# EasyEDA Pro project PowerStack.epro, schematic Schematic1
Board Name: Board1; Create Date: 2026-05-18; Page Name: P1; Project Name: Powerpi Stack; Schematic Name: Schematic1; Update Date: 2026-05-21; Company: EasyEDA.com; Page Size: A4; Version: V1.0
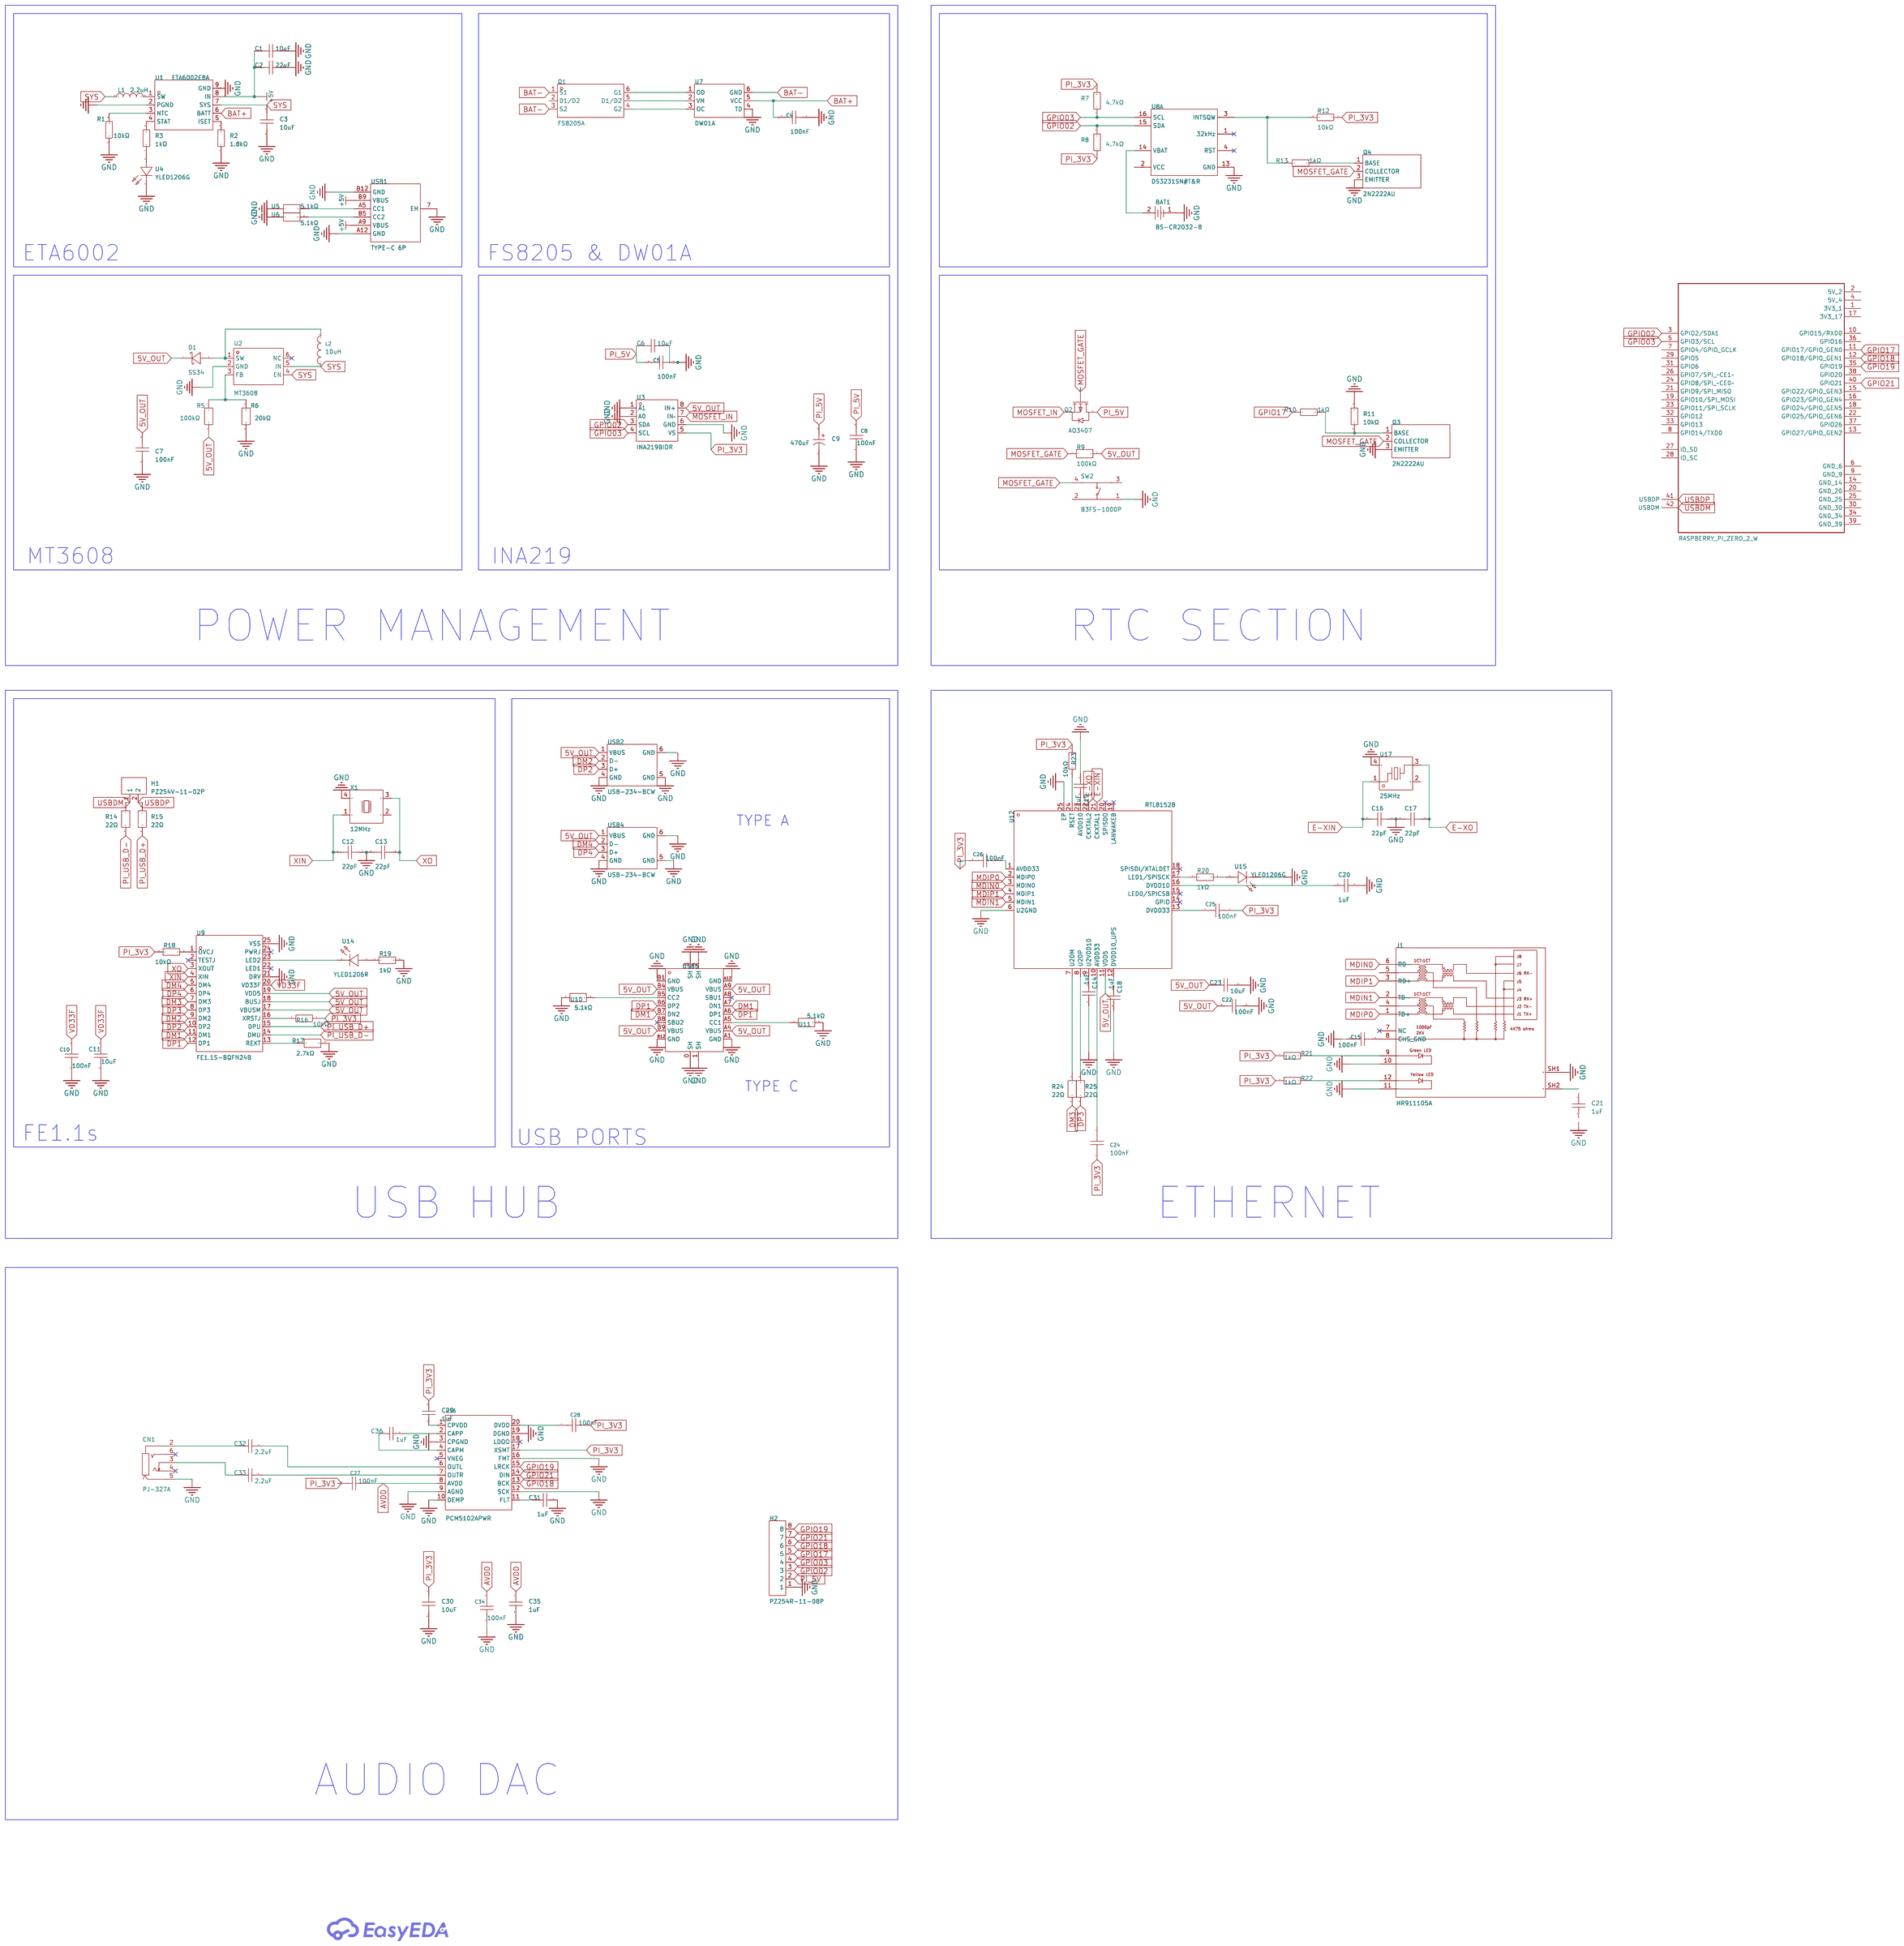
[diagram p0: schematic sheet]

## Parts
BAT1  BS-CR2032-8  [BAT-SMD_BS-CR2032-8]
C1  10uF  [C0603]
C2  22uF  [C0603]
C3  10uF  [C0603]
C4  100nF  [C0603]
C5  100nF  [C0603]
C6  10uF  [C0603]
C7  100nF  [C0603]
C8  100nF  [C0603]
C9  470uF  [CAP-SMD_BD6.3-L6.6-W6.6-FD]
C10  100nF  [C0603]
C11  10uF  [C0603]
C12  22pF  [C0603]
C13  22pF  [C0603]
C14  1uF  [C0603]
C15  100nF  [C0603]
C16  22pF  [C0603]
C17  22pF  [C0603]
C18  1uF  [C0603]
C19  1uF  [C0603]
C20  1uF  [C0603]
C21  1uF  [C0603]
C22  100nF  [C0603]
C23  10uF  [C0603]
C24  100nF  [C0603]
C25  100nF  [C0603]
C26  100nF  [C0603]
C27  100nF  [C0603]
C28  100nF  [C0603]
C29  1uF  [C0603]
C30  10uF  [C0603]
C31  1uF  [C0603]
C32  2.2uF  [C0603]
C33  2.2uF  [C0603]
C34  100nF  [C0603]
C35  1uF  [C0603]
C36  1uF  [C0603]
CN1  PJ-327A  [AUDIO-SMD_XUNPU_PJ-327A]
D1  SS34  [SMA_L4.3-W2.6-LS5.1-RD]
H1  PZ254V-11-02P  [HDR-TH_2P-P2.54-V-M]
H2  PZ254R-11-08P  [HDR-TH_8P-P2.54-H-M-W10.4]
J1  HR911105A  [RJ45-TH_HR911105A]
L1  2.2uH  [IND-SMD_L5.4-W5.2]
L2  10uH  [IND-SMD_L5.2-W5.2_MCW-0530]
Q1  FS8205A  [SOT-23-6_L2.9-W1.6-P0.95-LS2.8-BR]
Q2  AO3407  [SOT-23-3_L2.9-W1.6-P1.90-LS2.8-BR]
Q3  2N2222AU  [SOT-89-3_L4.5-W2.4-P1.50-LS4.0-BR]
Q4  2N2222AU  [SOT-89-3_L4.5-W2.4-P1.50-LS4.0-BR]
R1  10kΩ  [R0603_NEW]
R2  1.8kΩ  [R0603_NEW]
R3  1kΩ  [R0603_NEW]
R5  100kΩ  [R0603_NEW]
R6  20kΩ  [R0603_NEW]
R7  4.7kΩ  [R0603_NEW]
R8  4.7kΩ  [R0603_NEW]
R9  100kΩ  [R0603_NEW]
R10  1kΩ  [R0603_NEW]
R11  10kΩ  [R0603_NEW]
R12  10kΩ  [R0603_NEW]
R13  1kΩ  [R0603_NEW]
R14  22Ω  [R0603_NEW]
R15  22Ω  [R0603_NEW]
R16  10kΩ  [R0603_NEW]
R17  2.7kΩ  [R0603_NEW]
R18  10kΩ  [R0603_NEW]
R19  1kΩ  [R0603_NEW]
R20  1kΩ  [R0603_NEW]
R21  1kΩ  [R0603_NEW]
R22  1kΩ  [R0603_NEW]
R23  10kΩ  [R0603_NEW]
R24  22Ω  [R0603_NEW]
R25  22Ω  [R0603_NEW]
SW2  B3FS-1000P  [KEY-SMD_4P-L6.0-W6.3-P4.50-LS8.0]
U1  ETA6002E8A  [ESOP-8_L4.9-W3.9-P1.27-LS6.0-BL-EP-1]
U2  MT3608  [SOT-23-6_L2.9-W1.6-P0.95-LS2.8-BL]
U3  INA219BIDR  [SOIC-8_L5.0-W4.0-P1.27-LS6.1-BL]
U4  YLED1206G  [LED1206-RD]
U5  5.1kΩ  [R0603_NEW]
U6  5.1kΩ  [R0603_NEW]
U7  DW01A  [SOT-23-6_L2.9-W1.6-P0.95-LS2.8-BL]
U8  DS3231SN#T&R  [SOIC-16_L10.3-W7.5-P1.27-LS10.3-BL]  (section 1)
U9  FE1.1S-BQFN24B  [WQFN-24_L4.0-W4.0-P0.50-TL-EP2.7]
U10  5.1kΩ  [R0603_NEW]
U11  5.1kΩ  [R0603_NEW]
U12  RTL8152B  [QFN-24_L4.0-W4.0-P0.50-BL-EP2.0]
U14  YLED1206R  [LED1206-FD]
U15  YLED1206G  [LED1206-RD]
U16  PCM5102APWR  [TSSOP-20_L6.5-W4.4-P0.65-LS6.4-BL]
U17  25MHz  [CRYSTAL-SMD_4P-L2.0-W1.6-BL]
U18  RASPBERRY_PI_ZERO_2_W  [MODULE_RASPBERRY_PI_ZERO_2_W]
USB1  TYPE-C 6P  [TYPE-C-SMD_TYPE-C-6P_1]
USB2  USB-234-BCW  [USB-A-SMD_USB-234-BCW]
USB4  USB-234-BCW  [USB-A-SMD_USB-234-BCW]
USB5  TYPE C  [USB-C_SMD-TYPE-C-31-M-12]
X1  12MHz  [OSC-SMD_4P-L5.0-W3.2-BL_SG5032]

## Library data of the parts
BAT1 = BS-CR2032-8: Connector Type:Battery Holder Battery Type:CR2032 Contact Material:- Contact Plating:Gold Operating Temperature:-40℃~+85℃ Operating Temperature:-40℃~+85℃; LCSC Part Name: 电池底座 适用电池:CR2032; Supplier Part: C7498149; Manufacturer: LX(连欣科技); Supplier Footprint: SMD; JLCPCB Part Class: Extended Part; Datasheet: https://item.szlcsc.com/datasheet/BS-CR2032-8/8568591.html; Supplier: LCSC; Connector Type: Battery Holder; Battery Type: CR2032; Contact Plating: Gold; Operating Temperature: -40℃~+85℃
C1 C3 C6 C11 C23 C30 = CL10A106KP8NNNC: Capacitance:10uF Tolerance:±10% Tolerance:±10% Voltage Rating:10V Temperature Coefficient:X5R; LCSC Part Name: 10uF ±10% 10V; Supplier Part: C19702; Manufacturer: SAMSUNG(三星); Supplier Footprint: 0603; JLCPCB Part Class: Basic Part; Datasheet: https://item.szlcsc.com/datasheet/CL10A106KP8NNNC/20411.html; Supplier: LCSC; Tolerance: ±10%; Voltage Rating: 10V; Temperature Coefficient: X5R
C2 = CL10A226MP8NUNE: Capacitance:22uF Tolerance:±20% Tolerance:±20% Voltage Rating:10V Temperature Coefficient:X5R; LCSC Part Name: 22uF ±20% 10V; Supplier Part: C86295; Manufacturer: SAMSUNG(三星); Supplier Footprint: 0603; JLCPCB Part Class: Extended Part; Datasheet: https://item.szlcsc.com/datasheet/CL10A226MP8NUNE/87471.html; Supplier: LCSC; Tolerance: ±20%; Voltage Rating: 10V; Temperature Coefficient: X5R
C4 C5 C7 C8 C10 C15 C22 C24-C28 C34 = CC0603KRX7R9BB104: Capacitance:100nF Tolerance:±10% Tolerance:±10% Voltage Rating:50V Temperature Coefficient:X7R; LCSC Part Name: 100nF ±10% 50V; Supplier Part: C14663; Manufacturer: YAGEO(国巨); Supplier Footprint: 0603; JLCPCB Part Class: Basic Part; Datasheet: https://item.szlcsc.com/datasheet/CC0603KRX7R9BB104/15331.html; Supplier: LCSC; Tolerance: ±10%; Voltage Rating: 50V; Temperature Coefficient: X7R
C9 = 126RV0010: Capacitance:470uF Tolerance:±20% Tolerance:±20% Voltage Rating:16V Ripple Current:175mA@120Hz Equivalent Series Resistance(ESR):- Diameter:6.3mm Height - Seated (Max):7.7mm Lifetime:2000hrs@105℃ Operating Temperature:-55℃~+105℃ Operating Temperature:-55℃~; LCSC Part Name: 470uF ±20% 16V; Supplier Part: C5354997; Manufacturer: KNSCHA(科尼盛); Supplier Footprint: SMD,D6.3xL7.7mm; JLCPCB Part Class: Extended Part; Datasheet: https://item.szlcsc.com/datasheet/126RV0010/6154556.html; Supplier: LCSC; Tolerance: ±20%; Voltage Rating: 16V; Ripple Current: 175mA@120Hz; Diameter: 6.3mm; Height - Seated (Max): 7.7mm; Lifetime: 2000hrs@105℃; Operating Temperature: -55℃~+105℃
C12 C13 C16 C17 = TCC0805COG220J500BT: Capacitance:22pF Tolerance:±5% Tolerance:±5% Voltage Rating:50V Temperature Coefficient:C0G; LCSC Part Name: 22pF ±5% 50V; Supplier Part: C376875; Manufacturer: CCTC(三环); Supplier Footprint: 0805; JLCPCB Part Class: Extended Part; Datasheet: https://item.szlcsc.com/datasheet/TCC0805COG220J500BT/349234.html; Supplier: LCSC; Tolerance: ±5%; Voltage Rating: 50V; Temperature Coefficient: C0G
C14 C18-C21 C29 C31 C35 C36 = CL10B105KA8NNNC: Capacitance:1uF Tolerance:±10% Tolerance:±10% Voltage Rating:25V Temperature Coefficient:X7R; LCSC Part Name: 1uF ±10% 25V; Supplier Part: C29936; Manufacturer: SAMSUNG(三星); Supplier Footprint: 0603; JLCPCB Part Class: Extended Part; Datasheet: https://item.szlcsc.com/datasheet/CL10B105KA8NNNC/30690.html; Supplier: LCSC; Tolerance: ±10%; Voltage Rating: 25V; Temperature Coefficient: X7R
C32 C33 = CL10A225KO8NNNC: Capacitance:2.2uF Tolerance:±10% Tolerance:±10% Voltage Rating:16V Temperature Coefficient:X5R; LCSC Part Name: 2.2uF ±10% 16V; Supplier Part: C23630; Manufacturer: SAMSUNG(三星); Supplier Footprint: 0603; JLCPCB Part Class: Basic Part; Datasheet: https://item.szlcsc.com/datasheet/CL10A225KO8NNNC/24366.html; Supplier: LCSC; Tolerance: ±10%; Voltage Rating: 16V; Temperature Coefficient: X5R
CN1 = PJ-327A_C49284723: Connector Type:3.5mm Headphone Jack Current Rating:500mA Voltage Rating (Max):30V Contact Material:Copper Contact Plating:Gold Operating Temperature:-25℃~+85℃ Operating Temperature:-25℃~+85℃; LCSC Part Name: 3.5mm耳机座; Supplier Part: C49284723; Manufacturer: XUNPU(讯普); Supplier Footprint: SMD; JLCPCB Part Class: Extended Part; Datasheet: https://item.szlcsc.com/datasheet/PJ-327A/51736272.html; Supplier: LCSC; Connector Type: 3.5mm Headphone Jack; Current Rating: 500mA; Voltage Rating (Max): 30V; Contact Material: Copper; Contact Plating: Gold; Operating Temperature: -25℃~+85℃
D1 = SS34_C52023881: Supplier Part: C52023881; Manufacturer: Hangyu(航昱微); Supplier Footprint: SMA; JLCPCB Part Class: Extended Part; Datasheet: https://item.szlcsc.com/datasheet/SS34/54772671.html; Supplier: LCSC
H1 = PZ254V-11-02P: Pin Structure:1x2P Pitch:2.54mm Row Spacing:- Circluar Pins/Square Pins:Pin Header Mounting Type:Through Hole Number of Rows:1 Number of Pins:2P Current Rating:3A Voltage Rating (Max):250V Length of Mating Pin:6mm Insulation Height:2.5mm Length of End Con; LCSC Part Name: 1x2P 间距:2.54mm 方针 直插; Supplier Part: C492401; Manufacturer: XFCN(兴飞); Supplier Footprint: 插件,P=2.54mm; JLCPCB Part Class: Extended Part; Datasheet: https://item.szlcsc.com/datasheet/PZ254V-11-02P/502957.html; Supplier: LCSC; Pin Structure: 1x2P; Pitch: 2.54mm; Circluar Pins/Square Pins: Pin Header; Mounting Type: Through Hole; Number of Rows: 1; Number of Pins: 2P; Current Rating: 3A; Voltage Rating (Max): 250V; Length of Mating Pin: 6mm; Insulation Height: 2.5mm; Length of End Connection Pin: 3mm; Contact Material: Brass; Operating Temperature: -40℃~+105℃; Color: Black
H2 = PZ254R-11-08P: Pin Structure:1x8P Pitch:2.54mm Row Spacing:- Circluar Pins/Square Pins:Pin Header Mounting Type:Right Angle Number of Rows:1 Number of Pins:8P Current Rating:3A Voltage Rating (Max):250V Length of Mating Pin:6mm Insulation Height:2.5mm Length of End Conn; LCSC Part Name: 1x8P 间距:2.54mm 方针 弯插; Supplier Part: C492416; Manufacturer: XFCN(兴飞); Supplier Footprint: 弯插,P=2.54mm; JLCPCB Part Class: Extended Part; Datasheet: https://item.szlcsc.com/datasheet/PZ254R-11-08P/502972.html; Supplier: LCSC; Pin Structure: 1x8P; Pitch: 2.54mm; Circluar Pins/Square Pins: Pin Header; Mounting Type: Right Angle; Number of Rows: 1; Number of Pins: 8P; Current Rating: 3A; Voltage Rating (Max): 250V; Length of Mating Pin: 6mm; Insulation Height: 2.5mm; Contact Material: Brass; Operating Temperature: -40℃~+105℃; Color: Black
J1 = HR911105A_C12074: Connector Type:RJ45 Jack Mounting Type:Right Angle Number of Ports:1 LED:With LED Shielding:Shielded Ratings:- PoE:Non-PoE Supplementary Features:Filtered Contact Material:Phosphor Bronze Contact Plating:Gold Operating Temperature:0℃~+70℃ Operating Temper; LCSC Part Name: 弯插 带LED; Supplier Part: C12074; Manufacturer: HANRUN(汉仁); Supplier Footprint: 插件; JLCPCB Part Class: Extended Part; Datasheet: https://item.szlcsc.com/datasheet/HR911105A/12651.html; Supplier: LCSC; Connector Type: RJ45 Jack; Mounting Type: Right Angle; Number of Ports: 1; LED: With LED; Shielding: Shielded; PoE: Non-PoE; Supplementary Features: Filtered; Contact Material: Phosphor Bronze; Contact Plating: Gold; Operating Temperature: 0℃~+70℃
L1 = APH0530T2R2M: Inductance:2.2uH Tolerance:±20% Tolerance:±20% Current Rating:7A Current - Saturation(Isat):7A DC Resistance(DCR):29mΩ Type:Molded Inductor Ratings:-; LCSC Part Name: 2.2uH ±20% 7A; Supplier Part: C5349681; Manufacturer: APV(爱普微); Supplier Footprint: SMD,5.4x5.2mm; JLCPCB Part Class: Extended Part; Datasheet: https://item.szlcsc.com/datasheet/APH0530T2R2M/6135096.html; Supplier: LCSC; Tolerance: ±20%; Current Rating: 7A; Current - Saturation(Isat): 7A; DC Resistance(DCR): 29mΩ; Type: Molded Inductor
L2 = SMMS0530-100M: Inductance:10uH Tolerance:±20% Tolerance:±20% Current Rating:3.2A Current - Saturation(Isat):3.5A DC Resistance(DCR):125mΩ Type:-; LCSC Part Name: 10uH ±20% 3.5A; Supplier Part: C181721; Manufacturer: SXN(顺翔诺); Supplier Footprint: SMD,5.5x5.2mm; JLCPCB Part Class: Extended Part; Datasheet: https://item.szlcsc.com/datasheet/SMMS0530-100M/193118.html; Supplier: LCSC; Tolerance: ±20%; Current Rating: 3.2A; Current - Saturation(Isat): 3.5A; DC Resistance(DCR): 125mΩ
Q1 = FS8205A_C2830320: Type:2 N-Channel Drain Source Voltage (Vdss): Continuous Drain Current (Id): Drain Source On Resistance (RDS(on)@Vgs,Id):25mΩ@2.5V,3A Power Dissipation (Pd): Gate Threshold Voltage (Vgs(th)@Id):500mV@250uA Total Gate Charge (Qg@Vgs):5.7nC@10V Input Capaci; LCSC Part Name: 2个N沟道 耐压:20V 电流:6A; Supplier Part: C2830320; Manufacturer: TECH PUBLIC(台舟); Supplier Footprint: SOT-23-6; JLCPCB Part Class: Extended Part; Datasheet: https://atta.szlcsc.com/upload/public/pdf/source/20210810/F53B6D4E8755A1F8E11BAF814CE98E6A.pdf; Supplier: LCSC; Type: 2 N-Channel; Drain Source On Resistance (RDS(on)@Vgs,Id): 25mΩ@2.5V,3A; Gate Threshold Voltage (Vgs(th)@Id): 500mV@250uA; Total Gate Charge (Qg@Vgs): 5.7nC@10V; Input Capacitance (Ciss@Vds): 466pF@10V; Reverse Transfer Capacitance (Crss@Vds): 58pF@10V; Operating Temperature: -55℃~+150℃
Q2 = AO3407_C54839874: Supplier Part: C54839874; Manufacturer: YONGYUTAI(永裕泰); Supplier Footprint: SOT-23-3L; JLCPCB Part Class: Extended Part; Datasheet: https://item.szlcsc.com/datasheet/AO3407/58324898.html; Supplier: LCSC
Q3 Q4 = 2N2222AU: type:NPN Current - Collector(Ic):600mA Collector - Emitter Voltage VCEO:40V Pd - Power Dissipation:500mW DC Current Gain:300@150mA,10V DC Current Gain:300@150mA,10V Transition frequency(fT):300MHz Current - Collector Cutoff:10nA Vce Saturation(VCE(sat)):1; LCSC Part Name: NPN 电流:600mA 电压:40V; Supplier Part: C21714170; Manufacturer: CBI(创基); Supplier Footprint: SOT-89; JLCPCB Part Class: Extended Part; Datasheet: https://item.szlcsc.com/datasheet/2N2222AU/23141081.html; Supplier: LCSC; type: NPN; Current - Collector(Ic): 600mA; Collector - Emitter Voltage VCEO: 40V; Pd - Power Dissipation: 500mW; DC Current Gain: 300@150mA,10V; Transition frequency(fT): 300MHz; Current - Collector Cutoff: 10nA; Vce Saturation(VCE(sat)): 1V@500mA,50mA; Operating Temperature: -55℃~+150℃; Emitter-Base Voltage(Vebo): 6V; Number: 1 NPN
R1 R11 R12 R16 R18 R23 = RC0603FR-0710KL: Type:Thick Film Resistor Resistance:10kΩ Tolerance:±1% Tolerance:±1% Power(Watts):100mW Voltage-Supply(Max):75V Temperature Coefficient:±100ppm/℃ Temperature Coefficient:±100ppm/℃ Operating Temperature:-55℃~+155℃ Operating Temperature:-55℃~+155℃; LCSC Part Name: 厚膜电阻 10kΩ ±1% 100mW; Supplier Part: C98220; Manufacturer: YAGEO(国巨); Supplier Footprint: 0603; JLCPCB Part Class: Extended Part; Datasheet: https://item.szlcsc.com/datasheet/RC0603FR-0710KL/99429.html; Supplier: LCSC; Type: Thick Film Resistor; Tolerance: ±1%; Power(Watts): 100mW; Voltage-Supply(Max): 75V; Temperature Coefficient: ±100ppm/℃; Operating Temperature: -55℃~+155℃
R2 = RC0603FR-071K8L: Type:Thick Film Resistor Resistance:1.8kΩ Tolerance:±1% Tolerance:±1% Power(Watts):100mW Voltage-Supply(Max):75V Temperature Coefficient:±100ppm/℃ Temperature Coefficient:±100ppm/℃ Operating Temperature:-55℃~+155℃ Operating Temperature:-55℃~+155℃; LCSC Part Name: 厚膜电阻 1.8kΩ ±1% 100mW; Supplier Part: C185354; Manufacturer: YAGEO(国巨); Supplier Footprint: 0603; JLCPCB Part Class: Extended Part; Datasheet: https://item.szlcsc.com/datasheet/RC0603FR-071K8L/196759.html; Supplier: LCSC; Type: Thick Film Resistor; Tolerance: ±1%; Power(Watts): 100mW; Voltage-Supply(Max): 75V; Temperature Coefficient: ±100ppm/℃; Operating Temperature: -55℃~+155℃
R3 = RC0603FR-071KL: Type:Thick Film Resistor Resistance:1kΩ Tolerance:±1% Tolerance:±1% Power(Watts):100mW Voltage-Supply(Max):75V Temperature Coefficient:±100ppm/℃ Temperature Coefficient:±100ppm/℃ Operating Temperature:-55℃~+155℃ Operating Temperature:-55℃~+155℃; LCSC Part Name: 厚膜电阻 1kΩ ±1% 100mW; Supplier Part: C22548; Manufacturer: YAGEO(国巨); Supplier Footprint: 0603; JLCPCB Part Class: Extended Part; Datasheet: https://item.szlcsc.com/datasheet/RC0603FR-071KL/23274.html; Supplier: LCSC; Type: Thick Film Resistor; Tolerance: ±1%; Power(Watts): 100mW; Voltage-Supply(Max): 75V; Temperature Coefficient: ±100ppm/℃; Operating Temperature: -55℃~+155℃; Voltage Rating: 25V
R5 R9 = FRC0603F1003TS: Type:Thick Film Resistor Resistance:100kΩ Tolerance:±1% Tolerance:±1% Power(Watts):100mW Voltage-Supply(Max):75V Temperature Coefficient:±100ppm/℃ Temperature Coefficient:±100ppm/℃ Operating Temperature:-55℃~+155℃ Operating Temperature:-55℃~+155℃; LCSC Part Name: 100kΩ ±1% 100mW 厚膜电阻; Supplier Part: C2906980; Manufacturer: FOJAN(富捷); Supplier Footprint: 0603; JLCPCB Part Class: Extended Part; Supplier: LCSC; Type: Thick Film Resistor; Tolerance: ±1%; Power(Watts): 100mW; Voltage-Supply(Max): 75V; Temperature Coefficient: ±100ppm/℃; Operating Temperature: -55℃~+155℃
R6 = FRC0603F2002TS: Type:Thick Film Resistor Resistance:20kΩ Tolerance:±1% Tolerance:±1% Power(Watts):100mW Voltage-Supply(Max):75V Temperature Coefficient:±100ppm/℃ Temperature Coefficient:±100ppm/℃ Operating Temperature:-55℃~+155℃ Operating Temperature:-55℃~+155℃; LCSC Part Name: 20kΩ ±1% 100mW 厚膜电阻; Supplier Part: C2907011; Manufacturer: FOJAN(富捷); Supplier Footprint: 0603; JLCPCB Part Class: Extended Part; Supplier: LCSC; Type: Thick Film Resistor; Tolerance: ±1%; Power(Watts): 100mW; Voltage-Supply(Max): 75V; Temperature Coefficient: ±100ppm/℃; Operating Temperature: -55℃~+155℃
R7 R8 = RC0603FR-074K7L: Type:Thick Film Resistor Resistance:4.7kΩ Tolerance:±1% Tolerance:±1% Power(Watts):100mW Voltage-Supply(Max):75V Temperature Coefficient:±100ppm/℃ Temperature Coefficient:±100ppm/℃ Operating Temperature:-55℃~+155℃ Operating Temperature:-55℃~+155℃; LCSC Part Name: 厚膜电阻 4.7kΩ ±1% 100mW; Supplier Part: C99782; Manufacturer: YAGEO(国巨); Supplier Footprint: 0603; JLCPCB Part Class: Extended Part; Datasheet: https://item.szlcsc.com/datasheet/RC0603FR-074K7L/100996.html; Supplier: LCSC; Type: Thick Film Resistor; Tolerance: ±1%; Power(Watts): 100mW; Voltage-Supply(Max): 75V; Temperature Coefficient: ±100ppm/℃; Operating Temperature: -55℃~+155℃
R10 R13 R19-R22 = RC0603FR-071KL: Type:Thick Film Resistor Resistance:1kΩ Tolerance:±1% Tolerance:±1% Power(Watts):100mW Voltage-Supply(Max):75V Temperature Coefficient:±100ppm/℃ Temperature Coefficient:±100ppm/℃ Operating Temperature:-55℃~+155℃ Operating Temperature:-55℃~+155℃; LCSC Part Name: 厚膜电阻 1kΩ ±1% 100mW; Supplier Part: C22548; Manufacturer: YAGEO(国巨); Supplier Footprint: 0603; JLCPCB Part Class: Extended Part; Datasheet: https://item.szlcsc.com/datasheet/RC0603FR-071KL/23274.html; Supplier: LCSC; Type: Thick Film Resistor; Tolerance: ±1%; Power(Watts): 100mW; Voltage-Supply(Max): 75V; Temperature Coefficient: ±100ppm/℃; Operating Temperature: -55℃~+155℃
R14 R15 R24 R25 = FRC0603F22R0TS: Type:Thick Film Resistor Resistance:22Ω Tolerance:±1% Tolerance:±1% Power(Watts):100mW Voltage-Supply(Max):75V Temperature Coefficient:±100ppm/℃ Temperature Coefficient:±100ppm/℃ Operating Temperature:-55℃~+155℃ Operating Temperature:-55℃~+155℃; LCSC Part Name: 22Ω ±1% 100mW 厚膜电阻; Supplier Part: C2930077; Manufacturer: FOJAN(富捷); Supplier Footprint: 0603; JLCPCB Part Class: Extended Part; Supplier: LCSC; Type: Thick Film Resistor; Tolerance: ±1%; Power(Watts): 100mW; Voltage-Supply(Max): 75V; Temperature Coefficient: ±100ppm/℃; Operating Temperature: -55℃~+155℃
R17 = FRC0603F2701TS: Type:Thick Film Resistor Resistance:2.7kΩ Tolerance:±1% Tolerance:±1% Power(Watts):100mW Voltage-Supply(Max):75V Temperature Coefficient:±100ppm/℃ Temperature Coefficient:±100ppm/℃ Operating Temperature:-55℃~+155℃ Operating Temperature:-55℃~+155℃; LCSC Part Name: 2.7kΩ ±1% 100mW 厚膜电阻; Supplier Part: C2907008; Manufacturer: FOJAN(富捷); Supplier Footprint: 0603; JLCPCB Part Class: Extended Part; Datasheet: https://item.szlcsc.com/datasheet/FRC0603F2701TS/3180521.html; Supplier: LCSC; Type: Thick Film Resistor; Tolerance: ±1%; Power(Watts): 100mW; Voltage-Supply(Max): 75V; Temperature Coefficient: ±100ppm/℃; Operating Temperature: -55℃~+155℃
SW2 = B3FS-1000P: Circuit:SPST Actuator Style:Round Button Operating Force:100gf Mounting Style:Standing paste Switch Length:6.3mm Switch Width:6mm Switch Height:3.1mm Contact Current:50mA Voltage Rating (DC):24V With Lamp:- Pin Style:Gullwing Mechanical Life:- Operating T; LCSC Part Name: 6.3*6*3.1mm 立贴 轻触开关; Supplier Part: C271750; Manufacturer: OMRON(欧姆龙); Supplier Footprint: SMD,6x6mm; JLCPCB Part Class: Extended Part; Supplier: LCSC; Circuit: SPST; Actuator Style: Round Button; Operating Force: 100gf; Mounting Style: Standing paste; Switch Length: 6.3mm; Switch Width: 6mm; Switch Height: 3.1mm; Contact Current: 50mA; Voltage Rating (DC): 24V; Pin Style: Gullwing; Operating Temperature: -25℃~+70℃
U1 = ETA6002E8A: The Chip Type:Charging IC Voltage - Supply:4.4V~5.5V Voltage - Supply:4.4V~5.5V Charge Current - Max:2.5A Charging Saturation Voltage:4.2V End-Off Voltage:- Type of Battery:Lithium Battery Number of Cells:1 Number of Cells:1 Operating Temperature:-40℃~+85; LCSC Part Name: 2.5A, 3MHz开关充电器，带动态功率路径; Supplier Part: C7436031; Manufacturer: ETA(钰泰); Supplier Footprint: ESOP-8; JLCPCB Part Class: Extended Part; Datasheet: https://item.szlcsc.com/datasheet/ETA6002E8A/8453548.html; Supplier: LCSC; The Chip Type: Charging IC; Voltage - Supply: 4.4V~5.5V; Charge Current - Max: 2.5A; Charging Saturation Voltage: 4.2V; Type of Battery: Lithium Battery; Number of Cells: 1; Operating Temperature: -40℃~+85℃; Battery Temperature Detection: Support; 0V Battery Charge: Support; Supply Current (Iq): 70uA
U2 = MT3608: Function:Boost Output Type:Adjustable Voltage - Supply:2V~24V Voltage - Supply:2V~24V Output Voltage:- Output Voltage:- Output Current:2A Frequency - Switching:1.2MHz Frequency - Switching:1.2MHz Operating Temperature:-40℃~+85℃ Operating Temperature:-40℃~; LCSC Part Name: 老版本 高效1.2MHz 2A升压转换器; Supplier Part: C84817; Manufacturer: 西安航天民芯; Supplier Footprint: SOT-23-6; JLCPCB Part Class: Extended Part; Datasheet: https://item.szlcsc.com/datasheet/MT3608/85988.html; Supplier: LCSC; Function: Boost; Output Type: Adjustable; Voltage - Supply: 2V~24V; Output Current: 2A; Frequency - Switching: 1.2MHz; Operating Temperature: -40℃~+85℃; Synchronous Rectifier: No; Number of Outputs: 1; Topology: Boost; Quiescent Current: 100uA；1.6mA; Switch tube (built-in/external): Built-in
U3 = INA219BIDR: Number of Channels:- Vcm - Common Mode Voltage:300mV~26V Vcm - Common Mode Voltage:300mV~26V Gain:- Bandwidth:- Ib - Input Bias Current:20uA Vos - Input Offset Voltage:10uV Operating Temperature:-40℃~+125℃ Operating Temperature:-40℃~+125℃ Differential Vol; LCSC Part Name: 具有I2C接口的零漂移双向电流/功率监测计; Supplier Part: C2155799; Manufacturer: TI(德州仪器); Supplier Footprint: SOIC-8; JLCPCB Part Class: Extended Part; Datasheet: https://www.ti.com/cn/lit/gpn/ina219; Supplier: LCSC; Vcm - Common Mode Voltage: 300mV~26V; Ib - Input Bias Current: 20uA; Vos - Input Offset Voltage: 10uV; Operating Temperature: -40℃~+125℃; Differential Voltage: -26V~+26V; Single Supply: 3V~5.5V; Quiescent Current: 700uA; Input Offset Voltage Drift(Vos TC): 0.1uV/℃; Common Mode Rejection Ratio (CMRR): 120dB
U4 U15 = YLED1206G: Lamp Holder Type:- Illumination Color:Emerald Green Voltage - Forward(Vf):2.4V~3.1V Voltage - Forward(Vf):2.4V~3.1V Power(Watts):100mW Forward Current:20mA Wavelength - Dominant:516nm~531nm Wavelength - Dominant:516nm~531nm Peak Wavelength:525nm Peak Wave; LCSC Part Name: 发光管; Supplier Part: C30584801; Manufacturer: YONGYUTAI(永裕泰); Supplier Footprint: 1206; JLCPCB Part Class: Extended Part; Datasheet: https://item.szlcsc.com/datasheet/YLED1206G/32319013.html; Supplier: LCSC; Illumination Color: Emerald Green; Voltage - Forward(Vf): 2.4V~3.1V; Power(Watts): 100mW; Forward Current: 20mA; Wavelength - Dominant: 516nm~531nm; Peak Wavelength: 525nm; Diode Configuration: Discrete Diode; Lens Color: Water Clear; Luminous Intensity: 620mcd; Viewing Angle: 120°; Operating Temperature: -40℃~+85℃
U5 U6 U10 U11 = FRC0603F5101TS: Type:Thick Film Resistor Resistance:5.1kΩ Tolerance:±1% Tolerance:±1% Power(Watts):100mW Voltage-Supply(Max):75V Temperature Coefficient:±100ppm/℃ Temperature Coefficient:±100ppm/℃ Operating Temperature:-55℃~+155℃ Operating Temperature:-55℃~+155℃; LCSC Part Name: 5.1kΩ ±1% 100mW 厚膜电阻; Supplier Part: C2907044; Manufacturer: FOJAN(富捷); Supplier Footprint: 0603; JLCPCB Part Class: Extended Part; Supplier: LCSC; Type: Thick Film Resistor; Tolerance: ±1%; Power(Watts): 100mW; Voltage-Supply(Max): 75V; Temperature Coefficient: ±100ppm/℃; Operating Temperature: -55℃~+155℃
U7 = DW01A_C351410: The Chip Type:Protection IC Voltage - Supply:300mV~10V Voltage - Supply:300mV~10V Charge Current - Max:- Charging Saturation Voltage:4.3V End-Off Voltage:2.5V Type of Battery:Lithium Battery Number of Cells:1 Number of Cells:1 Operating Temperature:-40℃~+; LCSC Part Name: 单节锂离子/锂聚合物电池保护IC; Supplier Part: C351410; Manufacturer: PUOLOP(迪浦); Supplier Footprint: SOT-23-6L; JLCPCB Part Class: Extended Part; Datasheet: https://item.szlcsc.com/datasheet/DW01A/327628.html; Supplier: LCSC; The Chip Type: Protection IC; Voltage - Supply: 300mV~10V; Charging Saturation Voltage: 4.3V; End-Off Voltage: 2.5V; Type of Battery: Lithium Battery; Number of Cells: 1; Operating Temperature: -40℃~+85℃; Battery Temperature Detection: Not supported; 0V Battery Charge: Support; Supply Current (Iq): 3uA; Features: Overcurrent Protection；Overcharge protection；Over-discharge protection；Short-Circuit  Protection
U8 = DS3231SN#T&R: Interface:I2C crystal oscillator:Built-in Alarm Output:Yes Current - Supply:200uA Voltage - Supply:2.3V~5.5V Voltage - Supply:2.3V~5.5V Quiescent Current(Iq):0.84uA Operating Temperature:-40℃~+85℃ Operating Temperature:-40℃~+85℃ Features:Temperature compe; LCSC Part Name: 超高精度、I²C接口、集成RTC/TCXO/晶体; Supplier Part: C9866; Manufacturer: ADI(亚德诺)/MAXIM(美信); Supplier Footprint: SOIC-16-300mil; JLCPCB Part Class: Extended Part; Datasheet: https://item.szlcsc.com/datasheet/DS3231SN%2523T%2526R/10398.html; Supplier: LCSC; Interface: I2C; crystal oscillator: Built-in; Alarm Output: Yes; Current - Supply: 200uA; Voltage - Supply: 2.3V~5.5V; Quiescent Current(Iq): 0.84uA; Operating Temperature: -40℃~+85℃; Features: Temperature compensation；Alarm function；Programmable clock output
U9 = FE1.1S-BQFN24B: Applications Function:USB Hub USB Protocol:USB 2.0 Number of Channels:4 Voltage - Supply:4.5V~5.5V；3V~3.6V Voltage - Supply:4.5V~5.5V；3V~3.6V Data Rate:- Operating Temperature:0℃~+70℃ Operating Temperature:0℃~+70℃ Current - Supply:84mA Quiescent Supply Cu; LCSC Part Name: USB 2.0 4-端口集线器控制器; Supplier Part: C6776948; Manufacturer: TERMINUS; Supplier Footprint: WQFN-24; JLCPCB Part Class: Extended Part; Datasheet: https://item.szlcsc.com/datasheet/FE1.1S-BQFN24B/7735567.html; Supplier: LCSC; Applications Function: USB Hub; USB Protocol: USB 2.0; Number of Channels: 4; Voltage - Supply: 4.5V~5.5V；3V~3.6V; Operating Temperature: 0℃~+70℃; Current - Supply: 84mA; Quiescent Supply Current: 800uA
U12 = RTL8152B-VB-CG: Number of Channels:1 Interface:USB Voltage - Supply:3.3V Voltage - Supply:3.3V Current - Supply:24mA Operating Temperature:0℃~+70℃ Operating Temperature:0℃~+70℃; LCSC Part Name: 集成10/100M以太网控制器用于USB应用; Supplier Part: C50656; Manufacturer: REALTEK(瑞昱); Supplier Footprint: QFN-24-EP(4x4); JLCPCB Part Class: Extended Part; Supplier: LCSC; Number of Channels: 1; Interface: USB; Voltage - Supply: 3.3V; Current - Supply: 24mA; Operating Temperature: 0℃~+70℃
U14 = YLED1206R: Lamp Holder Type:- Illumination Color:Red Voltage - Forward(Vf):1.8V~2.4V Voltage - Forward(Vf):1.8V~2.4V Power(Watts):48mW Forward Current:20mA Wavelength - Dominant:615nm~630nm Wavelength - Dominant:615nm~630nm Peak Wavelength:635nm Peak Wavelength:635n; LCSC Part Name: 发光管; Supplier Part: C28310439; Manufacturer: YONGYUTAI(永裕泰); Supplier Footprint: 1206; JLCPCB Part Class: Extended Part; Datasheet: https://item.szlcsc.com/datasheet/YLED1206R/30046766.html; Supplier: LCSC; Illumination Color: Red; Voltage - Forward(Vf): 1.8V~2.4V; Power(Watts): 48mW; Forward Current: 20mA; Wavelength - Dominant: 615nm~630nm; Peak Wavelength: 635nm; Diode Configuration: Discrete Diode; Lens Color: Water Clear; Luminous Intensity: 175mcd; Viewing Angle: 120°; Operating Temperature: -40℃~+85℃
U16 = PCM5102APWR: Interface Type:PCM Supply Voltage:1.65V~3.46V Supply Voltage:1.65V~3.46V Number of Channels:2 Resolution:24；16；32 Operating Temperature:-25℃~+85℃ Operating Temperature:-25℃~+85℃; Supplier Part: C107671; Manufacturer: TI(德州仪器); Supplier Footprint: TSSOP-20; JLCPCB Part Class: Extended Part; Datasheet: https://www.ti.com/cn/lit/gpn/pcm5102a; Supplier: LCSC; Interface Type: PCM; Supply Voltage: 1.65V~3.46V; Number of Channels: 2; Resolution: 24；16；32; Operating Temperature: -25℃~+85℃
U17 = XL7EL89CKI-111YLC-25M: Type:Crystal Oscillator Frequency:25MHz Normal temperature Frequency Tolerance:±10ppm Normal temperature Frequency Tolerance:±10ppm Load Capacitance:8pF Frequency Stability:±20ppm Frequency Stability:±20ppm Operating Temperature:-40℃~+85℃ Operating Temper; LCSC Part Name: YSX211SL 25MHZ 8PF ±10PPM -40~85℃; Supplier Part: C19711739; Manufacturer: YXC(扬兴晶振); Supplier Footprint: SMD2016-4P; JLCPCB Part Class: Extended Part; Datasheet: https://item.szlcsc.com/datasheet/XL7EL89CKI-111YLC-25M/21021203.html; Supplier: LCSC; Type: Crystal Oscillator; Normal temperature Frequency Tolerance: ±10ppm; Load Capacitance: 8pF; Frequency Stability: ±20ppm; Operating Temperature: -40℃~+85℃
U18 = RASPBERRY_PI_ZERO_2_W
USB1 = TYPE-C 6P: Connector Type:Type-C Protocol Standard:- Gender:Female Mounting Type:Surface Mount, Right Angle Number of Contacts:6P Number of Ports:1 Current Rating-Power:3A Voltage Rating:5V Connect-Disconnect Life:3,000 Cycles Supplementary Features:- Center Height:; LCSC Part Name: 6P卧贴母座; Supplier Part: C456012; Manufacturer: SHOU HAN(首韩); Supplier Footprint: SMD; JLCPCB Part Class: Extended Part; Datasheet: https://item.szlcsc.com/datasheet/TYPE-C%25206P/458819.html; Supplier: LCSC; Connector Type: Type-C; Gender: Female; Mounting Type: Surface Mount, Right Angle; Number of Contacts: 6P; Number of Ports: 1; Current Rating-Power: 3A; Voltage Rating: 5V; Connect-Disconnect Life: 3,000 Cycles; Detection color: Black; Operating Temperature: -40℃~+85℃
USB2 USB4 = USB-234-BCW: Connector Type:Type-A Protocol Standard:USB 2.0 Gender:Female Mounting Type:Surface Mount, Right Angle Number of Contacts:4P Number of Ports:1 Current Rating-Power:1.5A Voltage Rating:30V Connect-Disconnect Life:5,000 Cycles Length:13.5mm Detection color:; LCSC Part Name: Type-A 母 卧贴; Supplier Part: C720528; Manufacturer: XUNPU(讯普); Supplier Footprint: SMD; JLCPCB Part Class: Extended Part; Datasheet: https://item.szlcsc.com/datasheet/USB-234-BCW/763535.html; Supplier: LCSC; Connector Type: Type-A; Protocol Standard: USB 2.0; Gender: Female; Mounting Type: Surface Mount, Right Angle; Number of Contacts: 4P; Number of Ports: 1; Current Rating-Power: 1.5A; Voltage Rating: 30V; Connect-Disconnect Life: 5,000 Cycles; Length: 13.5mm; Detection color: White; Operating Temperature: -20℃~+70℃
USB5 = USB-TYPE-C-018: Connector Type:Type-C Protocol Standard:- Gender:Female Mounting Type:Surface Mount, Right Angle Number of Contacts:16P Number of Ports:1 Current Rating-Power:3A Voltage Rating:5V Connect-Disconnect Life:10,000 cycles Length:7.35mm Operating Temperature:-; LCSC Part Name: Type-C 母 卧贴; Supplier Part: C2927038; Manufacturer: DEALON(德艺隆); Supplier Footprint: SMD; JLCPCB Part Class: Extended Part; Datasheet: https://item.szlcsc.com/datasheet/USB-TYPE-C-018/3252507.html; Supplier: LCSC; Connector Type: Type-C; Gender: Female; Mounting Type: Surface Mount, Right Angle; Number of Contacts: 16P; Number of Ports: 1; Current Rating-Power: 3A; Voltage Rating: 5V; Connect-Disconnect Life: 10,000 cycles; Length: 7.35mm; Operating Temperature: -25℃~+85℃
X1 = OVETGLJANF-12MHZ: Frequency:12MHz Voltage - Supply:3.3V Voltage - Supply:3.3V Current - Supply:10mA Frequency Stability:±50ppm Frequency Stability:±50ppm Operating Temperature:-40℃~+85℃ Operating Temperature:-40℃~+85℃; LCSC Part Name: 12MHz 3.3V; Supplier Part: C295511; Manufacturer: TAITIEN(泰艺电子); Supplier Footprint: SMD5032-4P; JLCPCB Part Class: Extended Part; Datasheet: https://item.szlcsc.com/datasheet/OVETGLJANF-12MHZ/279940.html; Supplier: LCSC; Voltage - Supply: 3.3V; Current - Supply: 10mA; Frequency Stability: ±50ppm; Operating Temperature: -40℃~+85℃

## Nets
5V_OUT: C7.2 C22.2 C23.1 D1.1(C) R5.2 R9.2 U3.8(IN+) U9.17(VBUSM) U9.18(BUSJ) U9.19(VDD5) U12.11(VDD5) USB2.1(VBUS) USB4.1(VBUS) USB5.A4(VBUS) USB5.A9(VBUS) USB5.B4(VBUS) USB5.B9(VBUS)
+5V: C1.1 C2.1 U1.8(IN) USB1.A9(VBUS) USB1.B9(VBUS)
AVDD: C27.1 C34.2 C35.1 U16.8(AVDD)
GND: BAT1.1 C1.2 C2.2 C3.2 C4.1 C5.1 C6.2 C7.1 C8.1 C9.2 C10.1 C11.2 C12.1 C13.1 C14.1 C15.2 C16.1 C17.1 C18.1 C19.1 C20.1 C22.1 C23.2 C30.2 C31.2 C34.1 C35.2 CN1.5 H2.1 J1.10 J1.11 J1.SH1 Q3.3(EMITTER) Q4.3(EMITTER) R1.1 R2.1 R6.1 R11.1 R17.2 R19.2 SW2.1 U1.9(GND) U2.2(GND) U3.1(A1) U3.2(A0) U3.6(GND) U4.1(K) U5.1 U6.1 U7.4(TD) U8.13(GND) U9.21(DRV) U9.25(VSS) U10.1 U11.2 U12.6(U2GND) U12.25(EP) U15.1(K) U16.3(CPGND) U16.9(AGND) U16.10(DEMP) U16.12(SCK) U16.16(FMT) U16.19(DGND) U17.4(GND) USB1.7(EH) USB1.A12(GND) USB1.B12(GND) USB2.4(GND) USB2.5(GND) USB2.6(GND) USB4.4(GND) USB4.5(GND) USB4.6(GND) USB5.0(SH) USB5.1(SH) USB5.2(SH) USB5.3(SH) USB5.A1(GND) USB5.A12(GND) USB5.B1(GND) USB5.B12(GND) X1.4(VCC)
PGND: U1.2(PGND)
BAT+: C4.2 U1.6(BATT) U7.5(VCC)
BAT-: Q1.1(S1) Q1.3(S2) U7.6(GND)
DM1: U9.11(DM1) USB5.A7(DN1) USB5.B7(DN2)
DM2: U9.9(DM2) USB2.2(D-)
DM3: R24.2 U9.7(DM3)
DM4: U9.5(DM4) USB4.2(D-)
DP1: U9.12(DP1) USB5.A6(DP1) USB5.B6(DP2)
DP2: U9.10(DP2) USB2.3(D+)
DP3: R25.2 U9.8(DP3)
DP4: U9.6(DP4) USB4.3(D+)
E-XIN: C16.2 U12.21(CKXTAL1) U17.1
E-XO: C17.2 U12.22(CKXTAL2) U17.3
GPIO02: H2.3 R8.2 U3.3(SDA) U8.15(SDA) U18.3(GPIO2/SDA1)
GPIO03: H2.4 R7.1 U3.4(SCL) U8.16(SCL) U18.5(GPIO3/SCL)
GPIO17: H2.5 R10.1 U18.11(GPIO17/GPIO_GEN0)
GPIO18: H2.6 U16.13(BCK) U18.12(GPIO18/GPIO_GEN1)
GPIO19: H2.8 U16.15(LRCK) U18.35(GPIO19)
GPIO21: H2.7 U16.14(DIN) U18.40(GPIO21)
MDIN0: J1.6(RD-) U12.3(MDIN0)
MDIN1: J1.2(TD-) U12.5(MDIN1)
MDIP0: J1.1(TD+) U12.2(MDIP0)
MDIP1: J1.3(RD+) U12.4(MDIP1)
MOSFET_GATE: Q2.1(G) Q3.2(COLLECTOR) Q4.2(COLLECTOR) R9.1 SW2.4
MOSFET_IN: Q2.2(S) U3.7(IN–)
PI_3V3: C24.2 C25.1 C26.2 C27.2 C28.2 C29.2 C30.1 R7.2 R8.1 R12.1 R16.1 R18.1 R21.2 R22.2 R23.2 U3.5(VS) U16.17(XSMT)
PI_5V: C5.2 C6.1 C8.2 C9.1 H2.2 Q2.3(D)
PI_USB_D+: R15.2 U9.15(DPU)
PI_USB_D-: R14.2 U9.14(DMU)
SYS: C3.1 L1.1 L2.1 U1.7(SYS) U2.4(EN) U2.5(IN)
USBDM: H1.1 R14.1 U18.42(USBDM)
USBDP: H1.2 R15.1 U18.41(USBDP)
VD33F: C10.2 C11.1 U9.20(VD33F)
XIN: C12.2 U9.4(XIN) X1.1(tri)
XO: C13.2 U9.3(XOUT) X1.3(OUT)
$1N1279: R1.2 U1.3(NTC)
$1N1380: R2.2 U1.5(ISET)
$1N1510: L1.2 U1.1(SW)
$1N1640: R3.2 U1.4(STAT)
$1N1679: R3.1 U4.2(A)
$1N1985: U6.2 USB1.B5(CC2)
$1N2024: U5.2 USB1.A5(CC1)
$1N2146: Q1.4(G2) U7.3(OC)
$1N2148: Q1.5(D1/D2) U7.2(VM)
$1N2150: Q1.6(G1) U7.1(OD)
$1N2988: D1.2(A) L2.2 U2.1(SW)
$1N3311: R5.1 R6.2 U2.3(FB)
$1N4067: BAT1.2 U8.14(VBAT)
$1N4875: Q3.1(BASE) R10.2 R11.2
$1N5005: R12.2 R13.1 U8.3(INTSQW)
$1N5104: Q4.1(BASE) R13.2
$1N6233: R16.2 U9.16(XRSTJ)
$1N6272: R17.1 U9.13(REXT)
$1N8172: R18.2 U9.1(OVCJ)
$1N8859: U11.1 USB5.A5(CC1)
$1N8861: U10.2 USB5.B5(CC2)
$1N12231: R19.1 U14.1
$1N12235: U9.23(LED2) U14.2
$1N12356: R20.1 U15.2(A)
$1N12384: R20.2 U12.17(LED1/SPISCK)
$1N12475: C14.2 U12.9(U2VDD10)
$1N13206: J1.12 R22.1
$1N13219: J1.9 R21.1
$1N13595: C19.2 U12.23(AVDD10)
$1N13631: C20.2 U12.16(DVDD10)
$1N13695: R23.1 U12.24(RSET)
$1N14319: C24.1 U12.10(AVDD33)
$1N14359: C25.2 U12.13(DVDD33)
$1N14433: C26.1 U12.1(AVDD33)
$1N17533: C28.1 U16.20(DVDD)
$1N17800: C31.1 U16.11(FLT)
$1N17886: C32.2 U16.6(OUTL)
$1N17922: C33.2 U16.7(OUTR)
$1N18109: C32.1 CN1.2
$1N18113: C33.1 CN1.3
$1N18349: C29.1 U16.1(CPVDD)
$1N18392: C36.1 U16.4(CAPM)
$1N18397: C36.2 U16.2(CAPP)
$1N32522: R24.1 U12.7(U2DM)
$1N32526: R25.1 U12.8(U2DP)
$1N46446: C15.1 J1.8(CHS GND)

Not connected (* = marked no-connect by the designer): C18 2; C21 1 2; CN1 4* 6*; J1 4 5 7(NC)* SH2; Q1 2(D1/D2); SW2 2 3; U2 6(NC)*; U8 1(32kHz)* 2(VCC) 4(RST)*; U9 2(TESTJ)* 22(LED1)* 24(PWRJ)*; U12 12(DVDD10_UPS) 14(GPIO)* 15(LED0/SPICSB)* 18(SPISDI/XTALDET)* 19(LANWAKEB)* 20(SPISDO)*; U16 5(VNEG)* 18(LDOO)*; U17 2(GND); U18 1(3V3) 2(5V) 4(5V) 6(GND) 7(GPIO4/GPIO_GCLK) 8(GPIO14/TXD0) 9(GND) 10(GPIO15/RXD0) 13(GPIO27/GPIO_GEN2) 14(GND) 15(GPIO22/GPIO_GEN3) 16(GPIO23/GPIO_GEN4) 17(3V3) 18(GPIO24/GPIO_GEN5) 19(GPIO10/SPI_MOSI) 20(GND) 21(GPIO9/SPI_MISO) 22(GPIO25/GPIO_GEN6) 23(GPIO11/SPI_SCLK) 24(GPIO8/SPI_~CE0~) 25(GND) 26(GPIO7/SPI_~CE1~) 27(ID_SD) 28(ID_SC) 29(GPIO5) 30(GND) 31(GPIO6) 32(GPIO12) 33(GPIO13) 34(GND) 36(GPIO16) 37(GPIO26) 38(GPIO20) 39(GND); USB5 A8(SBU1)* B8(SBU2)*; X1 2(GND)

## Notes on the sheet
- ETA6002
- FS8205 & DW01A
- MT3608
- INA219
- POWER MANAGEMENT
- RTC SECTION
- TYPE A
- TYPE C
- FE1.1s
- USB PORTS
- USB HUB
- ETHERNET
- AUDIO DAC
